# Altium schematic sheet Comm_Sheet.SchDoc
size A3; SheetNumber: 4; SheetTotal: 5
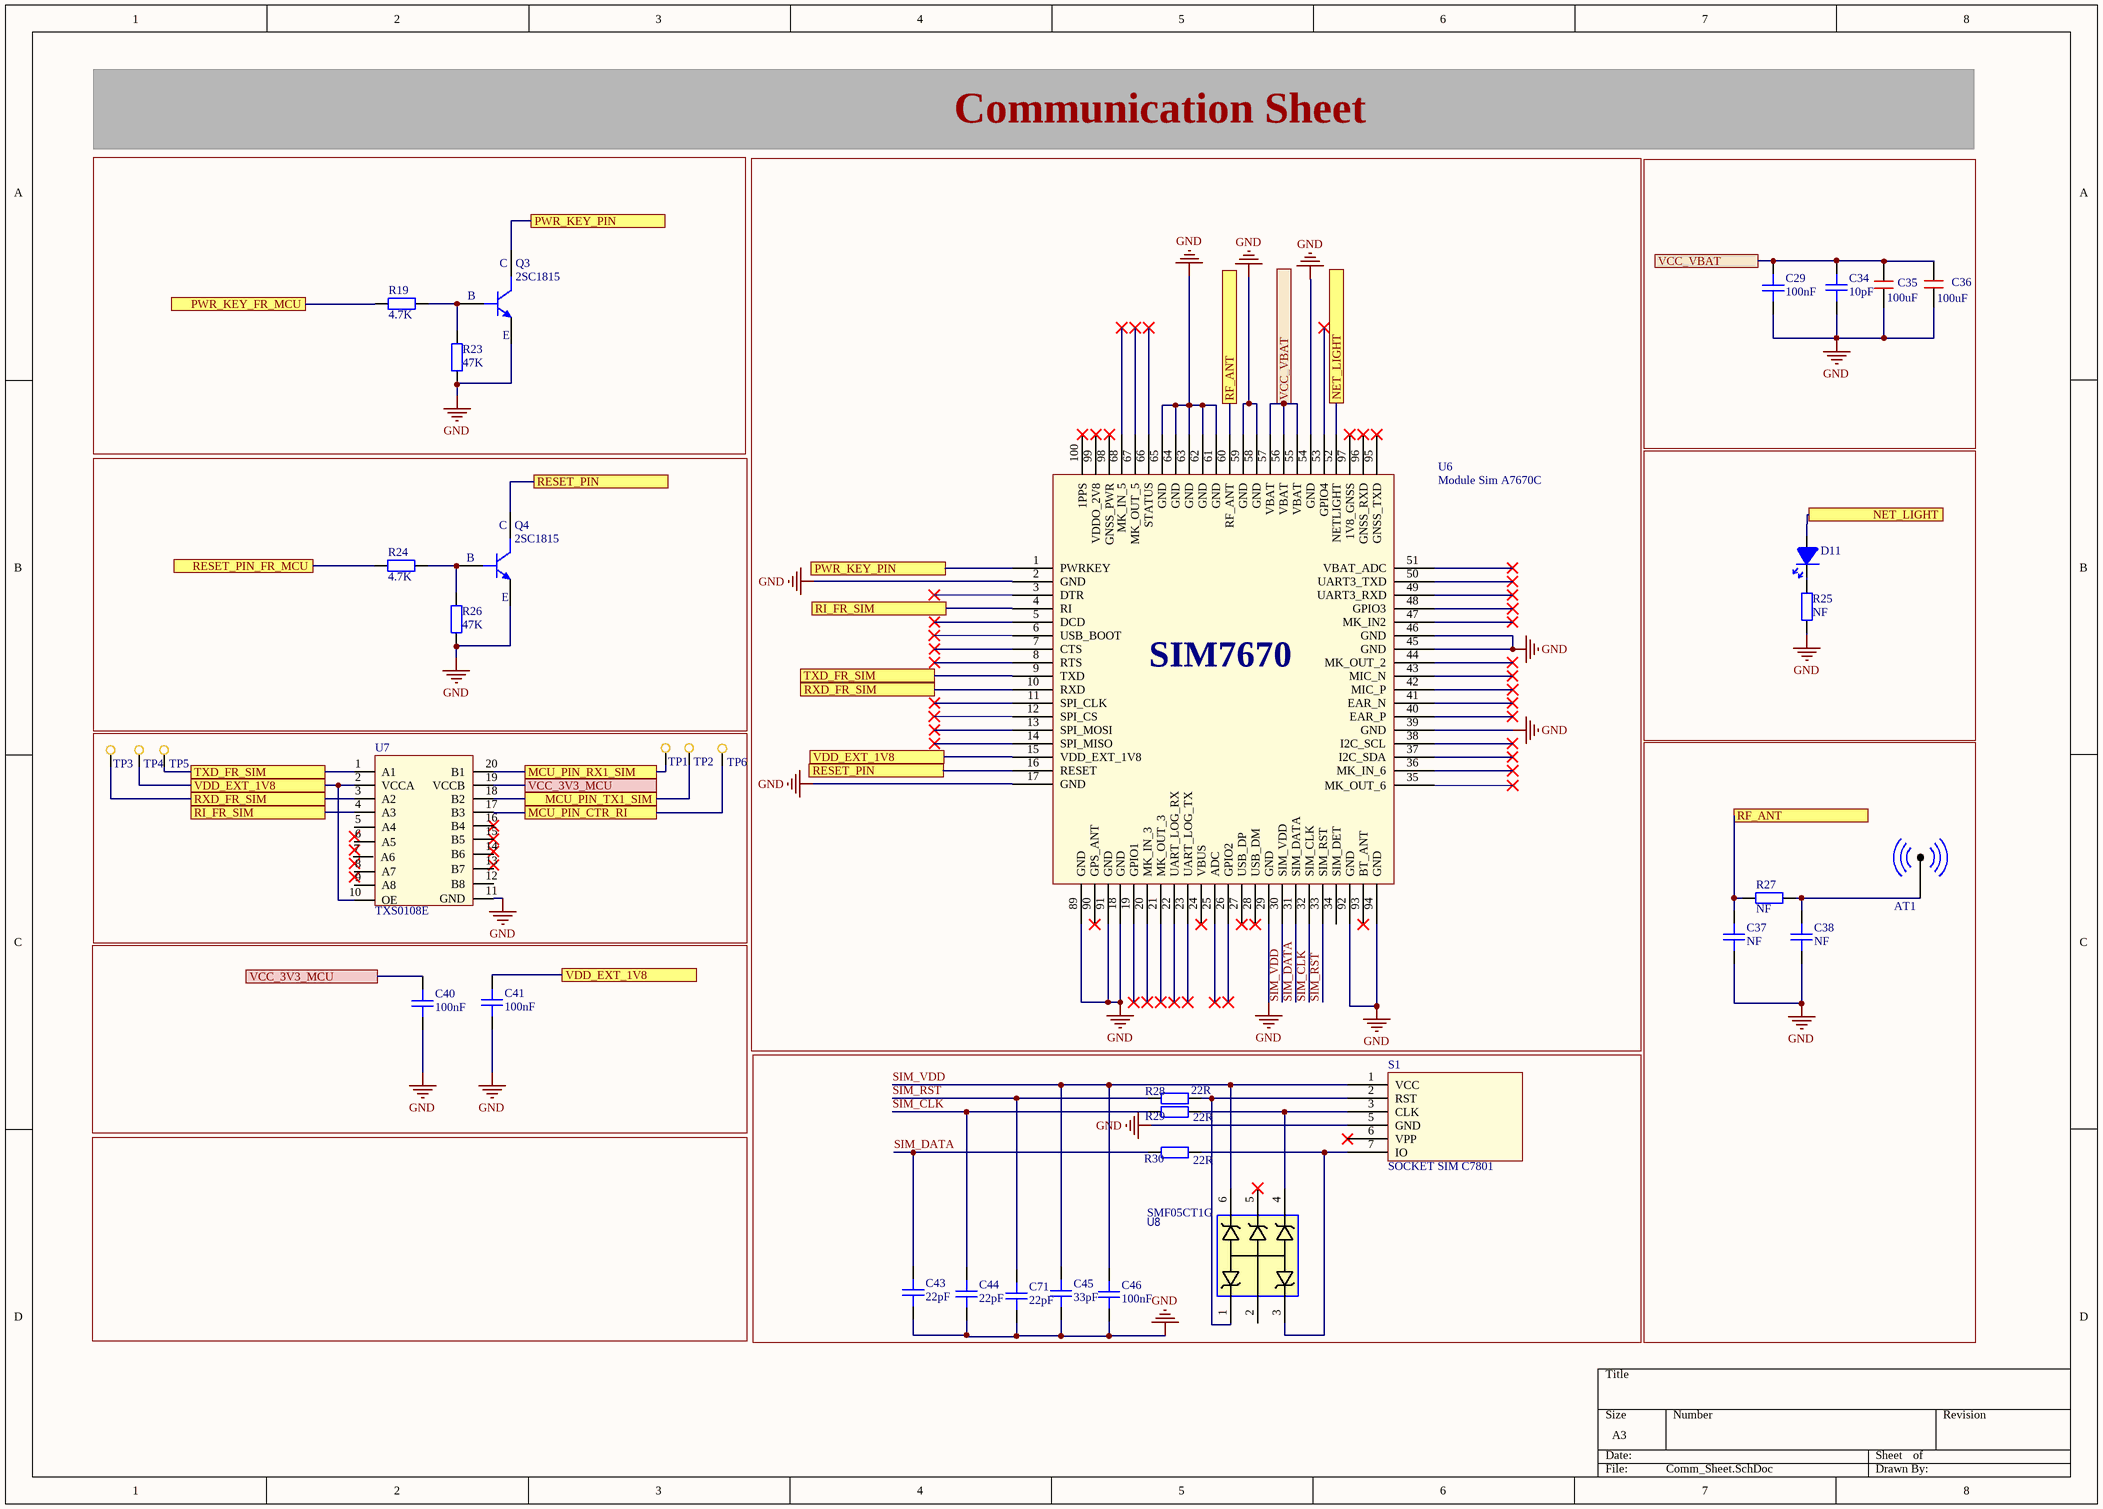
[diagram p0: Comm_Sheet.SchDoc]

## Parts
AT1  AT-GSM-GPS  [ANTENA - SMA2]  (value not drawn)
C29  100nF  [CAPC-0603 (1608)]
C34  10pF  [CAPC-0603 (1608)]
C35  100uF  [100uF 1210 SMD]
C36  100uF  [100uF 1210 SMD]
C37  NF  [CAPC-0603 (1608)]
C38  NF  [CAPC-0603 (1608)]
C40  100nF  [CAPC-0603 (1608)]
C41  100nF  [CAPC-0603 (1608)]
C43  22pF  [CAPC-0603 (1608)]
C44  22pF  [CAPC-0603 (1608)]
C45  33pF  [CAPC-0603 (1608)]
C46  100nF  [CAPC-0603 (1608)]
C71  22pF  [CAPC-0603 (1608)]
D11  LED_0805_PW  [LED_0805_PW]  (value not drawn)
Q3  2SC1815  [SOT23_3]
Q4  2SC1815  [SOT23_3]
R19  4.7K  [RESC-0603 (1608)]
R23  47K  [RESC-0603 (1608)]
R24  4.7K  [RESC-0603 (1608)]
R25  NF  [RESC-0603 (1608)]
R26  47K  [RESC-0603 (1608)]
R27  NF  [RESC-0603 (1608)]
R28  22R  [RESC-0603 (1608)]
R29  22R  [RESC-0603 (1608)]
R30  22R  [RESC-0603 (1608)]
S1  SOCKET SIM C7801  [SOCKET SIM]
TP1  Testpoint-1mm  [TestPoint]  (value not drawn)
TP2  Testpoint-1mm  [TestPoint]  (value not drawn)
TP3  Testpoint-1mm  [TestPoint]  (value not drawn)
TP4  Testpoint-1mm  [TestPoint]  (value not drawn)
TP5  Testpoint-1mm  [TestPoint]  (value not drawn)
TP6  Testpoint-1mm  [TestPoint]  (value not drawn)
U6  Module Sim A7670C  [Module Sim A7670C]
U7  TXS0108E  [TXS0108E]
U8  SMF05CT1G  [SOT363]

## Ports
MCU_PIN_CTR_RI, MCU_PIN_RX1_SIM, MCU_PIN_TX1_SIM, NET_LIGHT, PWR_KEY_FR_MCU, PWR_KEY_PIN, RESET_PIN, RESET_PIN_FR_MCU, RF_ANT, RI_FR_SIM, RXD_FR_SIM, TXD_FR_SIM, VCC_3V3_MCU, VCC_VBAT, VDD_EXT_1V8

## Nets
GND: C29.1 C34.1 C35.1 C36.1 C37.1 C38.1 C40.1 C41.1 C43.1 C44.1 C45.1 C46.1 C71.1 Q3.2(E) Q4.2(E) R23.2 R25.1 R26.2 S1.5(GND) U6.2(GND) U6.17(GND) U6.18(GND) U6.29(GND) U6.39(GND) U6.45(GND) U6.46(GND) U6.54(GND) U6.58(GND) U6.59(GND) U6.61(GND) U6.62(GND) U6.63(GND) U6.64(GND) U6.65(GND) U6.89(GND) U6.91(GND) U6.92(GND) U6.94(GND) U7.11(GND)
MCU_PIN_CTR_RI: TP6.1 U7.17(B3) ; port MCU_PIN_CTR_RI
MCU_PIN_RX1_SIM: TP1.1 U7.20(B1) ; port MCU_PIN_RX1_SIM
MCU_PIN_TX1_SIM: TP2.1 U7.18(B2) ; port MCU_PIN_TX1_SIM
NET_LIGHT: D11.1(A) U6.52(NETLIGHT) ; port NET_LIGHT
PWR_KEY_FR_MCU: R19.2 ; port PWR_KEY_FR_MCU
PWR_KEY_PIN: Q3.3(C) U6.1(PWRKEY) ; port PWR_KEY_PIN
RESET_PIN: Q4.3(C) U6.16(RESET) ; port RESET_PIN
RESET_PIN_FR_MCU: R24.2 ; port RESET_PIN_FR_MCU
RF_ANT: C37.2 R27.2 U6.60(RF_ANT) ; port RF_ANT
RI_FR_SIM: U6.4(RI) U7.4(A3) ; port RI_FR_SIM
RXD_FR_SIM: TP3.1 U6.10(RXD) U7.3(A2) ; port RXD_FR_SIM
SIM_CLK: C44.2 R29.2 U6.32(SIM_CLK)
SIM_DATA: C43.2 R30.2 U6.31(SIM_DATA)
SIM_RST: C71.2 R28.2 U6.33(SIM_RST)
SIM_VDD: C45.2 C46.2 S1.1(VCC) U6.30(SIM_VDD) U8.6(CT5)
TXD_FR_SIM: TP5.1 U6.9(TXD) U7.1(A1) ; port TXD_FR_SIM
VCC_3V3_MCU: C40.2 U7.19(VCCB) ; port VCC_3V3_MCU
VCC_VBAT: C29.2 C34.2 C35.2 C36.2 U6.55(VBAT) U6.56(VBAT) U6.57(VBAT) ; port VCC_VBAT
VDD_EXT_1V8: C41.2 TP4.1 U6.15(VDD_EXT_1V8) U7.2(VCCA) U7.10(OE) ; port VDD_EXT_1V8
NetAT1_1: AT1.1(AT) C38.2 R27.1
NetD11_2: D11.2(K) R25.2
NetQ3_1: Q3.1(B) R19.1 R23.1
NetQ4_1: Q4.1(B) R24.1 R26.1
NetR28_1: R28.1 S1.2(RST) U8.1(CT1)
NetR29_1: R29.1 S1.3(CLK) U8.4(CT3)
NetR30_1: R30.1 S1.7(IO) U8.3(CT2)

Not connected (* = marked no-connect by the designer): AT1 2; S1 6(VPP)*; U6 3(DTR)* 5(DCD)* 6(USB_BOOT)* 7(CTS)* 8(RTS)* 11(SPI_CLK)* 12(SPI_CS)* 13(SPI_MOSI)* 14(SPI_MISO)* 19(GPIO1)* 20(MK_IN_3)* 21(MK_OUT_3)* 22(UART_LOG_RX)* 23(UART_LOG_TX)* 24(VBUS)* 25(ADC)* 26(GPIO2)* 27(USB_DP)* 28(USB_DM)* 34(SIM_DET) 35(MK_OUT_6)* 36(MK_IN_6)* 37(I2C_SDA)* 38(I2C_SCL)* 40(EAR_P)* 41(EAR_N)* 42(MIC_P)* 43(MIC_N)* 44(MK_OUT_2)* 47(MK_IN2)* 48(GPIO3)* 49(UART3_RXD)* 50(UART3_TXD)* 51(VBAT_ADC)* 53(GPIO4)* 66(STATUS)* 67(MK_OUT_5)* 68(MK_IN_5)* 90(GPS_ANT)* 93(BT_ANT)* 95(GNSS_TXD)* 96(GNSS_RXD)* 97(1V8_GNSS)* 98(GNSS_PWR)* 99(VDDO_2V8)* 100(1PPS)*; U7 5(A4) 6(A5) 7(A6) 8(A7) 9(A8) 12(B8) 13(B7) 14(B6) 15(B5)* 16(B4)*; U8 2(AN) 5(CT4)*

## Notes on the sheet
- Communication Sheet
- (in symbol Module Sim A7670C) SIM7670

## Library data of the parts
AT1 = RFCON171003SF6B001: CONNECTER ANTENNA GPS GSM; Solder: HAND; CompanyID: VT-00392; MPN: RFCON171003SF6B001; Value: AT-GSM-GPS
C29 C34 C40 C41 C43-C46 C71 = CAPC NF 0603: CAP SMD, Not Fill, 0603; Value: NF; Solder: Not Fill; Category: CAPACITOR
C35 C36 = CAP SMD 1210 100uF
C37 C38 = CAPC NF 0603: CAP SMD, Not Fill, 0603; Solder: Not Fill; Value: NF; Category: CAPACITOR
Q3 Q4 = 2SC1815: TRANS NPN 50V 0.15A SOT23-3; Solder: SMT; MPN: 2SC1815; Value: 2SC1815
R19 R23 R24 R26 R28-R30 = RESC NF 0603: RES SMD, Not Fill, 0603; Value: NF; Solder: Not Fill; Category: RESISTOR
R25 R27 = RESC NF 0603: RES SMD, Not Fill, 0603; Solder: Not Fill; Value: NF; Category: RESISTOR
U8 = SMF05CT1G: TVS DIODE 5VWM 12.5VC SC88; CompanyID: VT-00105; Solder: SMT; MPN: SMF05CT1G; Value: SMF05CT1G